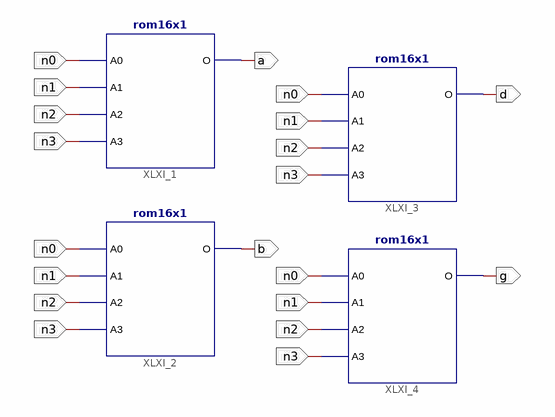
[diagram p0: schematic sheet 1]
// Xilinx ISE schematic abdg.sch (spartan3e) as structural Verilog: 4 symbols, 8 ports
module abdg (
  input  n0,
  input  n1,
  input  n2,
  input  n3,
  output b,
  output a,
  output g,
  output d
);

  rom16x1 #(.INIT("2812")) XLXI_1 (.A0(n0), .A1(n1), .A2(n2), .A3(n3), .O(a));
  rom16x1 #(.INIT("D860")) XLXI_2 (.A0(n0), .A1(n1), .A2(n2), .A3(n3), .O(b));
  rom16x1 #(.INIT("8492")) XLXI_3 (.A0(n0), .A1(n1), .A2(n2), .A3(n3), .O(d));
  rom16x1 #(.INIT("1083")) XLXI_4 (.A0(n0), .A1(n1), .A2(n2), .A3(n3), .O(g));
endmodule
